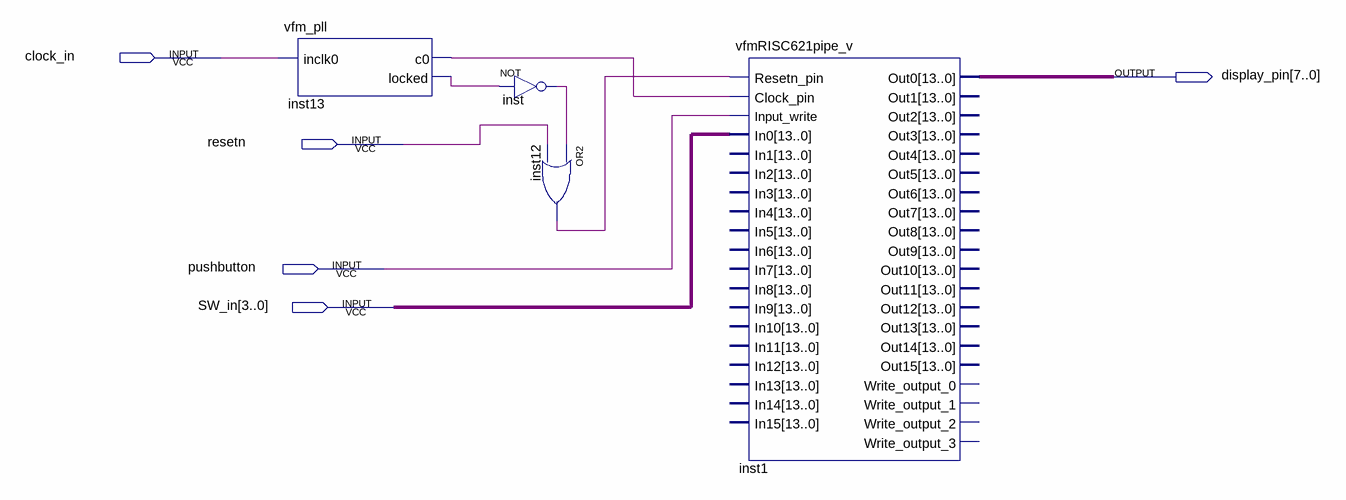
[diagram p0: schematic sheet]
// Quartus schematic vfm6849_top.bdf as structural Verilog: 4 symbols, 5 pins
module vfm6849_top (
  input  clock_in,
  input  resetn,
  input  pushbutton,
  input  [3:0] SW_in,
  output [7:0] display_pin
);

  wire inst12_out, inst13_c0, inst13_locked, inst_out;

  vfm_pll inst13 (.inclk0(clock_in), .c0(inst13_c0), .locked(inst13_locked));
  not inst (inst_out, inst13_locked);
  or inst12 (inst12_out, inst_out, resetn);
  vfmRISC621pipe_v inst1 (
    .Resetn_pin(inst12_out), .Clock_pin(inst13_c0), .Input_write(pushbutton), .In0(SW_in), .Out0(display_pin));  // open: In1, In2, In3, In4, In5, In6, In7, In8, In9, In10, In11, In12, In13, In14, In15, Out1, Out2, Out3, Out4, Out5, Out6, Out7, Out8, Out9, Out10, Out11, Out12, Out13, Out14, Out15, Write_output_0, Write_output_1, Write_output_2, Write_output_3
endmodule
